# EasyEDA Pro project 51单片机核心板.epro

# Schematic 51单片机核心板原理图
Create Date: 2024-02-12; Page Name: P1; Project Name: 51单片机核心板; Schematic Name: 51单片机核心板原理图; Update Date: 2024-02-13; Company: 南京信息工程大学; Drawed: expert; Page Size: A4; Version: V1.0
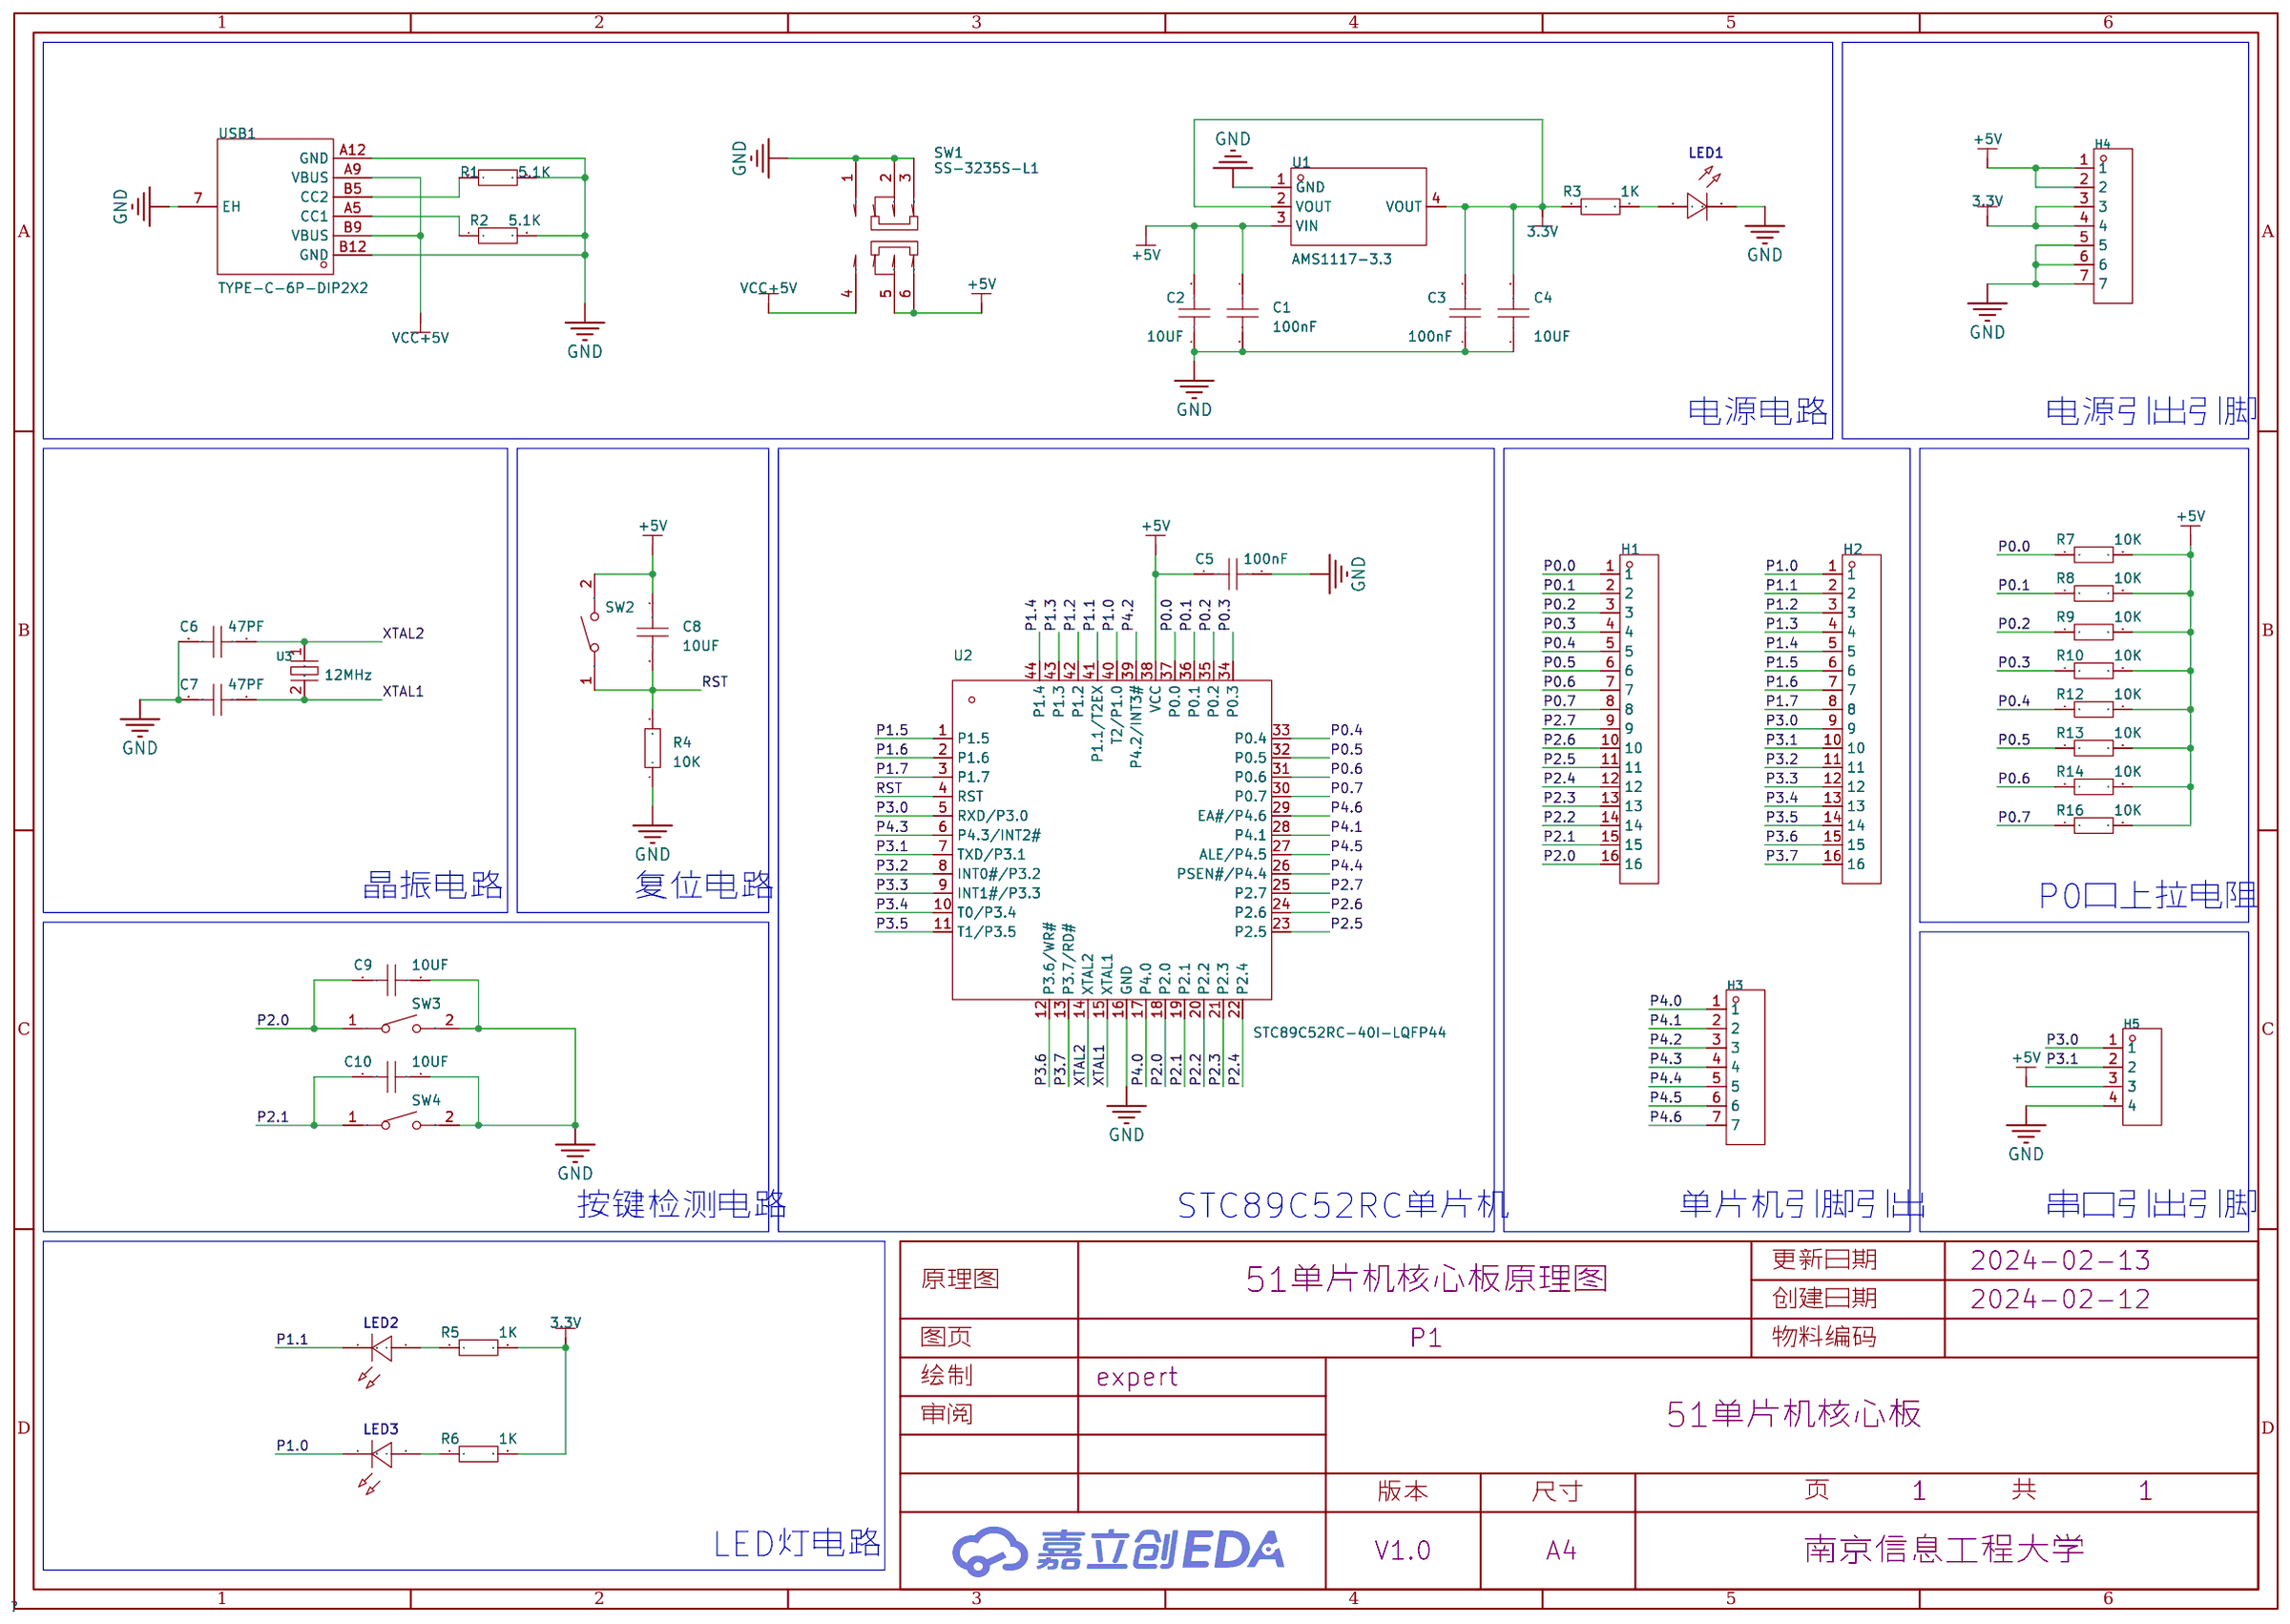
[diagram p0: schematic sheet]

## Parts
C1  100nF  [C0805]
C2  10UF  [C0805]
C3  100nF  [C0805]
C4  10UF  [C0805]
C5  100nF  [C0805]
C6  47PF  [C0805]
C7  47PF  [C0805]
C8  10UF  [C0805]
C9  10UF  [C0805]
C10  10UF  [C0805]
H1  -  [HDR-TH_16P-P2.54-V-M]
H2  -  [HDR-TH_16P-P2.54-V-M]
H3  -  [HDR-TH_7P-P2.54-V-M]
H4  -  [HDR-TH_7P-P2.54-V-M]
H5  -  [HDR-TH_4P-P2.54-V-M]
LED1  -  [LED_0805]
LED2  -  [LED_0805]
LED3  -  [LED_0805]
R1  5.1K  [R0805]
R2  5.1K  [R0805]
R3  1K  [R0805]
R4  10K  [R0805]
R5  1K  [R0805]
R6  1K  [R0805]
R7  10K  [R0805]
R8  10K  [R0805]
R9  10K  [R0805]
R10  10K  [R0805]
R12  10K  [R0805]
R13  10K  [R0805]
R14  10K  [R0805]
R16  10K  [R0805]
SW1  SS-3235S-L1  [SW-SMD_SS-3235S-LX]
SW2  轻触按键3*4*H  [SW-SMD_L4.0-W2.9-LS5.0]
SW3  轻触按键3*4*H  [SW-SMD_L4.0-W2.9-LS5.0]
SW4  轻触按键3*4*H  [SW-SMD_L4.0-W2.9-LS5.0]
U1  AMS1117-3.3  [SOT-223-3_L6.5-W3.4-P2.30-LS7.0-BR]
U2  STC89C52RC-40I-LQFP44  [LQFP-44_L10.0-W10.0-P0.80-LS12.0-BL]
U3  12MHz  [CRYSTAL-SMD_L11.4-W4.7-LS12.7]
USB1  TYPE-C-6P-DIP2X2  [TYPE-C-SMD_TYPE-C-6P]

## Library data of the parts
C1-C10 = CAP_0805: Supplier Footprint: 0805
H1 H2 = HDR-M_2.54_1x16P: 间距:2.54mm;总PIN位数:16;排数:1;插针结构:1x16P;行距:-;安装类型:直插;圆针/方针:方针;额定电流:3A;额定电压:-;配合针长度:6mm;塑高:2.5mm;端接针长度:3mm;触头材质:-;工作温度范围:-40℃~+105℃;颜色:黑色;; Supplier Part: C2894939; Supplier Footprint: 插件
H3 H4 = HDR-M_2.54_1x7P: Supplier Part: C492406; Supplier Footprint: 插件
H5 = HDR-M_2.54_1x4P: Supplier Part: C492403; Supplier Footprint: 插件
LED1-LED3 = LED_0805-G: Supplier Footprint: 0805
R1-R10 R12-R14 R16 = Res_0805: Supplier Footprint: 0805
SW1 = SS-3235S-L1: 电路结构:双刀双掷;安装方式:卧贴;开关颜色:黑色;额定电流(DC):50mA;额定电压(DC):12V;额定电流(AC):50mA;额定电压(AC):12V;机械寿命:1万次;; LCSC Part Name: 柄长2mm 卧贴双档 滑动开关; Supplier Part: C500055; Manufacturer: XKB Connectivity(中国星坤); Supplier Footprint: SMD; JLCPCB Part Class: 扩展库; Datasheet: https://atta.szlcsc.com/upload/public/pdf/source/20211011/39D516E750C13BE9339464E723D9F132.pdf; Supplier: LCSC; Circuit: 双刀双掷; Actuator Style: 矩形柱状; Pin Style: 鸥翼型; Switch Length: 9.1mm; Switch Width: 3.55mm; Switch Height: 3.2mm; Mounting Style: 卧贴; Actuator Color: 黑色; Current Rating (DC): 50mA; Voltage Rating (DC): 12V; Current Rating (AC): 50mA; Voltage Rating (AC): 12V; Mechanical Life: 1万次; Operating Temperature: -40℃~+85℃
SW2-SW4 = 轻触按键3*4*H: Supplier Part: C9900017573; Supplier Footprint: 轻触按键3*4*2.5; JLCPCB Part Class: 扩展库; Supplier: LCSC
U1 = AMS1117-3.3_C6186: 输出类型:固定;最大输入电压:-;输出电压:3.3V;最大输出电流:1A;电源纹波抑制比(PSRR):72dB@(120Hz);输出极性:正极;; LCSC Part Name: 输出3.3V 1A; Supplier Part: C6186; Manufacturer: AMS; Supplier Footprint: SOT-223-3; JLCPCB Part Class: 基础库; Datasheet: https://atta.szlcsc.com/upload/public/pdf/source/20180727/C6186_7A095716F0823C02F1997A905E26C086.pdf; Supplier: LCSC; Output Type: 固定; Output Voltage: 3.3V; MAX Output Current: 1A; Power Supply Rejection Ratio (PSRR): 72dB@(120Hz); Dropout Voltage: 1.3V@(800mA); Output Polarity: 正极; Number of Outputs: 1
U2 = STC89C52RC-40I-LQFP44: CPU内核:51系列;程序存储容量:8KB;RAM总容量:512Byte;GPIO端口数量:39;工作电压范围:3.3V~5.5V;CPU最大主频:-;程序存储器类型:FLASH;; Supplier Part: C8707; Manufacturer: STC(宏晶); Supplier Footprint: LQFP-44(10x10); JLCPCB Part Class: 扩展库; Datasheet: https://atta.szlcsc.com/upload/public/pdf/source/20131218/1457706663573.pdf; Supplier: LCSC; CPU Core: 51系列; Program Storage Size: 8KB; RAM Size: 512Byte; GPIO Ports Number: 39; Operating Voltage Range: 3.3V~5.5V; Program Memory Type: FLASH; Operating Temperature Range: -40℃~+85℃; 16Bit Timer: 3; UART/USART: 1; Peripheral/Function: 看门狗; Watchdog: 有
U3 = ABLS-12.000MHZ-B4H-T: 频率:12MHz;常温频差:±30ppm;外接负载电容:18pF;频率稳定度(全温):±35ppm;; LCSC Part Name: 12MHz ±30ppm 18pF; Supplier Part: C1986452; Manufacturer: ABRACON; Supplier Footprint: HC-49S-SMD; JLCPCB Part Class: 扩展库; Datasheet: https://atta.szlcsc.com/upload/public/pdf/source/20210612/96A8D0E14BE5C26ADD56CBF11909D043.pdf; Supplier: LCSC; Normal temperature Frequency Tolerance: ±30ppm; External load capacitor: 18pF; Frequency Stability(Full temperature range): ±35ppm; Equivalent Series Resistance (ESR): 50Ω; Operating Temperature: -20℃~+70℃
USB1 = TYPE-C-6P-DIP2X2: Supplier Part: C9900017627; Supplier Footprint: TYPE-C-6P; JLCPCB Part Class: 扩展库; Supplier: LCSC

## Nets
3.3V: C3.2 C4.2 H4.3 H4.4 R3.1 R5.2 R6.2 U1.2(VOUT) U1.4(VOUT)
+5V: C1.1 C2.2 C5.1 C8.1 H4.1 H4.2 H5.3 R7.2 R8.2 R9.2 R10.2 R12.2 R13.2 R14.2 R16.2 SW1.5 SW1.6 SW2.2 U1.3(VIN) U2.38(VCC)
GND: C1.2 C2.1 C3.1 C4.1 C5.2 C6.2 C7.2 C9.2 C10.2 H4.5 H4.6 H4.7 H5.4 LED1.1(C) R1.2 R2.2 R4.1 SW1.1 SW1.2 SW1.3 SW3.2 SW4.2 U1.1(GND) U2.16(GND) USB1.7(EH) USB1.A12(GND) USB1.B12(GND)
VCC+5V: SW1.4 USB1.A9(VBUS) USB1.B9(VBUS)
P0.0: H1.1 R7.1 U2.37(P0.0)
P0.1: H1.2 R8.1 U2.36(P0.1)
P0.2: H1.3 R9.1 U2.35(P0.2)
P0.3: H1.4 R10.1 U2.34(P0.3)
P0.4: H1.5 R12.1 U2.33(P0.4)
P0.5: H1.6 R13.1 U2.32(P0.5)
P0.6: H1.7 R14.1 U2.31(P0.6)
P0.7: H1.8 R16.1 U2.30(P0.7)
P1.0: H2.1 LED3.1(C) U2.40(T2/P1.0)
P1.1: H2.2 LED2.1(C) U2.41(P1.1/T2EX)
P1.2: H2.3 U2.42(P1.2)
P1.3: H2.4 U2.43(P1.3)
P1.4: H2.5 U2.44(P1.4)
P1.5: H2.6 U2.1(P1.5)
P1.6: H2.7 U2.2(P1.6)
P1.7: H2.8 U2.3(P1.7)
P2.0: C9.1 H1.16 SW3.1 U2.18(P2.0)
P2.1: C10.1 H1.15 SW4.1 U2.19(P2.1)
P2.2: H1.14 U2.20(P2.2)
P2.3: H1.13 U2.21(P2.3)
P2.4: H1.12 U2.22(P2.4)
P2.5: H1.11 U2.23(P2.5)
P2.6: H1.10 U2.24(P2.6)
P2.7: H1.9 U2.25(P2.7)
P3.0: H2.9 H5.1 U2.5(RXD/P3.0)
P3.1: H2.10 H5.2 U2.7(TXD/P3.1)
P3.2: H2.11 U2.8(INT0#/P3.2)
P3.3: H2.12 U2.9(INT1#/P3.3)
P3.4: H2.13 U2.10(T0/P3.4)
P3.5: H2.14 U2.11(T1/P3.5)
P3.6: H2.15 U2.12(P3.6/WR#)
P3.7: H2.16 U2.13(P3.7/RD#)
P4.0: H3.1 U2.17(P4.0)
P4.1: H3.2 U2.28(P4.1)
P4.2: H3.3 U2.39(P4.2/INT3#)
P4.3: H3.4 U2.6(P4.3/INT2#)
P4.4: H3.5 U2.26(PSEN#/P4.4)
P4.5: H3.6 U2.27(ALE/P4.5)
P4.6: H3.7 U2.29(EA#/P4.6)
RST: C8.2 R4.2 SW2.1 U2.4(RST)
XTAL1: C7.1 U2.15(XTAL1) U3.2(GND)
XTAL2: C6.1 U2.14(XTAL2) U3.1
$1N199: R1.1 USB1.B5(CC2)
$1N203: R2.1 USB1.A5(CC1)
$1N789: LED1.2(A) R3.2
$1N4250: LED2.2(A) R5.1
$1N4257: LED3.2(A) R6.1

## Notes on the sheet
- 电源电路
- 电源引出引脚
- 晶振电路
- 复位电路
- P0口上拉电阻
- 按键检测电路
- STC89C52RC单片机
- 单片机引脚引出
- 串口引出引脚
- LED灯电路

# Board 51单片机核心板PCB
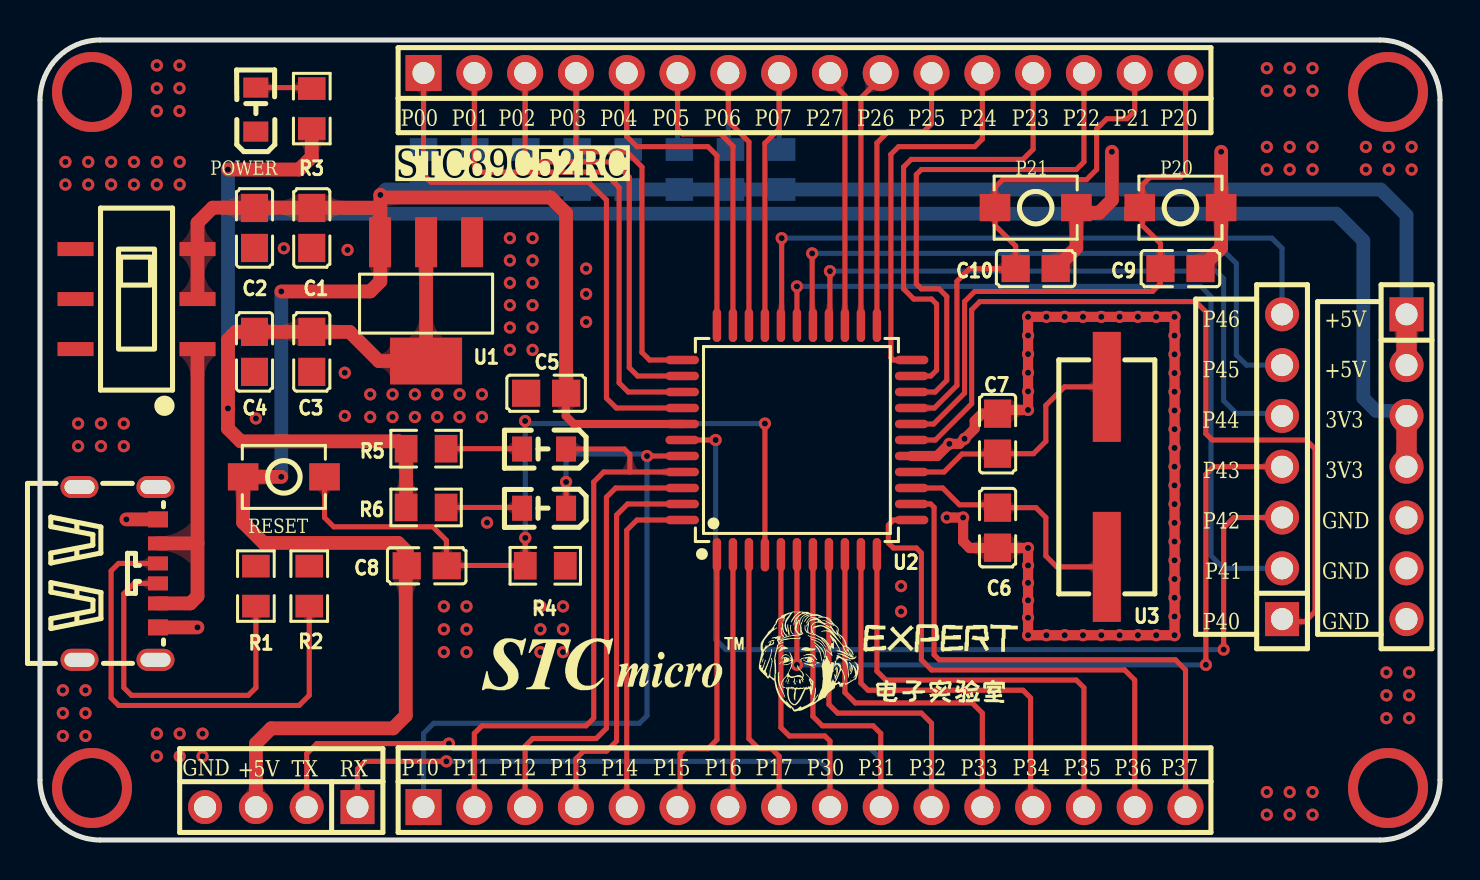
[diagram p1: board, top side]
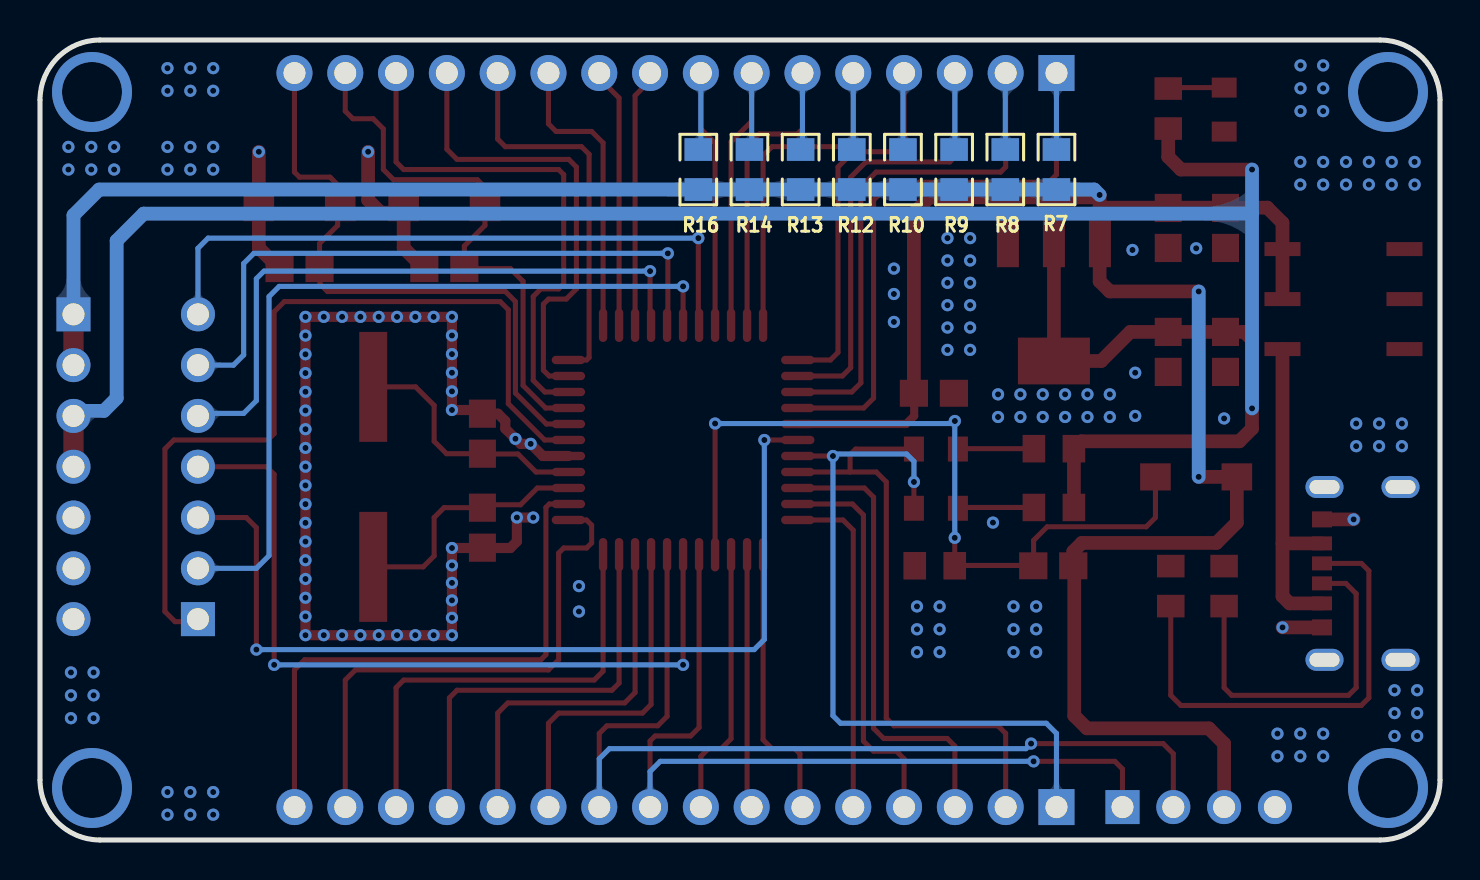
[diagram p2: board, bottom side, seen from below]

Outline 70 x 40 mm; copper layers: Top Layer, Bottom Layer. Coordinates in mm from the lower left corner of the outline.
Outline path: 0,37 0,3 arc(0.88,0.88) 3,0 67,0 arc(69.12,0.88) 70,3 70,37 arc(69.12,39.12) 67,40 3,40 arc(0.88,39.12) 0,37
Stack: Top Layer 0.035mm / Dielectric1 1.51mm FR4 er 4.5 / Bottom Layer 0.035mm

## Design rules (mm)
net XTAL2: DP1
net XTAL1: DP1
template: JLCPCB Capability(Two Layers Board)
spacing copperThickness1oz (default): track to track 0.102, other pairs 0.152 to 0.3
spacing copperThickness2oz: track to track 0.203, other pairs 0.152 to 0.3
track width copperThickness1oz (default): min 0.127, default 0.254, max 2.54
track width copperThickness2oz: min 0.203, default 0.254, max 2.54
differential pair differentialPair (default): width min 0.127, default 0.254, max 2.54; gap min 0.152, default 0.152
via viaSize (default): diameter min 0.5, default 0.61, max 10; hole min 0.3, default 0.305, max 6.3

## Placement (name value [footprint] x y rotation side)
C1  100nF  [C0805]  13.59 30.6 270 top
C2  10UF  [C0805]  10.72 30.6 90 top
C3  100nF  [C0805]  13.59 24.41 90 top
C4  10UF  [C0805]  10.72 24.41 90 top
C5  100nF  [C0805]  25.31 22.34 180 top
C6  47PF  [C0805]  47.88 15.62 270 top
C7  47PF  [C0805]  47.88 20.31 90 top
C8  10UF  [C0805]  19.34 13.71 0 top
C9  10UF  [C0805]  57.02 28.57 0 top
C10  10UF  [C0805]  49.78 28.57 0 top
H1  -  [HDR-TH_16P-P2.54-V-M]  38.23 38.35 0 top
H2  -  [HDR-TH_16P-P2.54-V-M]  38.23 1.65 0 top
H3  -  [HDR-TH_7P-P2.54-V-M]  62.1 18.66 90 top
H4  -  [HDR-TH_7P-P2.54-V-M]  68.33 18.66 270 top
H5  -  [HDR-TH_4P-P2.54-V-M]  12.06 1.65 180 top
LED1  -  [LED_0805]  10.8 36.57 90 top
LED2  -  [LED_0805]  25.15 19.55 180 top
LED3  -  [LED_0805]  25.15 16.59 180 top
R1  5.1K  [R0805]  10.8 12.69 90 top
R2  5.1K  [R0805]  13.46 12.69 90 top
R3  1K  [R0805]  13.59 36.57 90 top
R4  10K  [R0805]  25.26 13.71 180 top
R5  1K  [R0805]  19.3 19.57 180 top
R6  1K  [R0805]  19.3 16.63 180 top
R7  10K  [R0805]  19.18 33.52 270 bottom
R8  10K  [R0805]  21.74 33.52 270 bottom
R9  10K  [R0805]  24.29 33.52 270 bottom
R10  10K  [R0805]  26.85 33.52 270 bottom
R12  10K  [R0805]  29.41 33.52 270 bottom
R13  10K  [R0805]  31.97 33.52 270 bottom
R14  10K  [R0805]  34.53 33.52 270 bottom
R16  10K  [R0805]  37.08 33.52 270 bottom
SW1  SS-3235S-L1  [SW-SMD_SS-3235S-LX]  4.83 27.05 90 top
SW2  轻触按键3*4*H  [SW-SMD_L4.0-W2.9-LS5.0]  12.19 18.16 180 top
SW3  轻触按键3*4*H  [SW-SMD_L4.0-W2.9-LS5.0]  57.02 31.62 0 top
SW4  轻触按键3*4*H  [SW-SMD_L4.0-W2.9-LS5.0]  49.78 31.62 0 top
U1  AMS1117-3.3  [SOT-223-3_L6.5-W3.4-P2.30-LS7.0-BR]  19.3 26.92 90 top
U2  STC89C52RC-40I-LQFP44  [LQFP-44_L10.0-W10.0-P0.80-LS12.0-BL]  37.85 20 0 top
U3  12MHz  [CRYSTAL-SMD_L11.4-W4.7-LS12.7]  53.34 18.16 90 top
USB1  TYPE-C-6P-DIP2X2  [TYPE-C-SMD_TYPE-C-6P]  3.94 13.33 270 top

## Footprints (pads in the part's own frame, mm; a bottom-side part is the same pattern mirrored in y, then rotated)
C0805
  rect 1.41x1.35 smd: 1(-1,0) 2(1,0)
CRYSTAL-SMD_L11.4-W4.7-LS12.7
  rect 5.5x1.4 smd: 1(-4.5,0) 2(4.5,0)
HDR-TH_4P-P2.54-V-M
  rect 1.7x1.7 hole 1.1: 1(-3.81,0)
  round 1.7 hole 1.1: 2(-1.27,0) 3(1.27,0) 4(3.81,0)
HDR-TH_7P-P2.54-V-M
  rect 1.7x1.7 hole 1.1: 1(-7.62,0)
  round 1.7 hole 1.1: 2(-5.08,0) 3(-2.54,0) 4(0,0) 5(2.54,0) 6(5.08,0) 7(7.62,0)
HDR-TH_16P-P2.54-V-M
  rect 1.8x1.8 hole 1.1: 1(-19.05,0)
  round 1.8 hole 1.1: 2(-16.51,0) 3(-13.97,0) 4(-11.43,0) 5(-8.89,0) 6(-6.35,0) 7(-3.81,0) 8(-1.27,0) 9(1.27,0) 10(3.81,0) 11(6.35,0) 12(8.89,0) 13(11.43,0) 14(13.97,0) 15(16.51,0) 16(19.05,0)
LED_0805
  rect 1x1.25 smd: 1(-1.15,0.005) 2(1.05,0.005)
LQFP-44_L10.0-W10.0-P0.80-LS12.0-BL
  oval 0.42x1.67 smd: 1(-4,-5.735) 2(-3.2,-5.735) 3(-2.4,-5.735) 4(-1.6,-5.735) 5(-0.8,-5.735) 6(0,-5.735) 7(0.8,-5.735) 8(1.6,-5.735) 9(2.4,-5.735) 10(3.2,-5.735) 11(4,-5.735) 23(4,5.735) 24(3.2,5.735) 25(2.4,5.735) 26(1.6,5.735) 27(0.8,5.735) 28(0,5.735) 29(-0.8,5.735) 30(-1.6,5.735) 31(-2.4,5.735) 32(-3.2,5.735) 33(-4,5.735)
  oval 1.67x0.42 smd: 12(5.735,-4) 13(5.735,-3.2) 14(5.735,-2.4) 15(5.735,-1.6) 16(5.735,-0.8) 17(5.735,0) 18(5.735,0.8) 19(5.735,1.6) 20(5.735,2.4) 21(5.735,3.2) 22(5.735,4) 34(-5.735,4) 35(-5.735,3.2) 36(-5.735,2.4) 37(-5.735,1.6) 38(-5.735,0.8) 39(-5.735,0) 40(-5.735,-0.8) 41(-5.735,-1.6) 42(-5.735,-2.4) 43(-5.735,-3.2) 44(-5.735,-4)
R0805
  rect 1.133x1.377 smd: 1(-1,0) 2(1,0)
SOT-223-3_L6.5-W3.4-P2.30-LS7.0-BR
  rect 2.5x1.1 smd: 1(2.97,-2.3) 2(2.97,0) 3(2.97,2.3)
  rect 2.34x3.6 smd: 4(-2.97,0)
SW-SMD_L4.0-W2.9-LS5.0
  rect 1.53x1.36 smd: 1(-2.035,0) 2(2.035,0)
SW-SMD_SS-3235S-LX
  rect 0.7x1.8 smd: 1(-2.5,3.05) 2(0,3.05) 3(2.5,3.05) 4(-2.5,-3.05) 5(0,-3.05) 6(2.5,-3.05)
TYPE-C-SMD_TYPE-C-6P
  oval 1.1x1.9 hole 0.7x1.5: 7(-4.32,1.837) 7(-4.32,-1.962) 7(4.32,1.837) 7(4.32,-1.962)
  rect 0.7x1 smd: A5(-0.5,1.962) A9(1.5,1.962) B5(0.5,1.962) B9(-1.5,1.962)
  rect 0.8x1 smd: A12(2.7,1.962) B12(-2.7,1.962)

## Nets
As in the schematic.

## Via types
v1: diameter 4, hole 3, Top Layer to Bottom Layer, 4 vias
v2: diameter 0.61, hole 0.305, Top Layer to Bottom Layer, 185 vias

## Routing (per net, layer and track width the routed paths; a pad name or vN(x,y) marks a point on that pad's centre or on a via; arc(x,y) is an arc through that point)
3.3V: length 121.4
  Top Layer w0.686: U1.2 U1.4 16.94,23.95 15.48,25.41 C3.2 C4.2 9.79,25.41 9.4,25.01 v2(9.4,21.58) 9.4,20.57 10.03,19.93 17.94,19.93 R5.2 R6.2 ; v2(9.4,33.52) 12.95,33.52 13.59,34.16 R3.1
  Top Layer w1.016: H4.3 H4.4
  Bottom Layer w0.686: v2(9.4,21.58) 9.4,31.32 ; 9.4,31.32 v2(9.4,33.52) ; 9.4,31.32 64.82,31.32 66.17,29.97 66.17,22.09 66.8,21.46 68.07,21.46 H4.3
+5V: length 149.8
  Top Layer w0.406: C5.1 26.29,22.32 26.29,21.2 26.69,20.8 U2.38
  Top Layer w0.686: H5.3 10.8,4.82 11.56,5.58 17.65,5.58 18.29,6.22 18.29,13.66 C8.1 18.34,14.42 17.91,14.85 11.18,14.85 10.16,15.87 SW2.2 v2(12.06,18.16) ; 10.71,31.62 13.57,31.62 ; 10.71,31.62 C2.2 ; 10.71,31.62 8.64,31.62 7.88,30.86 SW1.6 SW1.5 ; 13.57,31.62 C1.1 ; 13.57,31.62 17.02,31.62 ; 17.02,31.62 v2(17.02,32.25) 17.14,32.13 25.53,32.13 26.31,31.35 C5.1 ; 17.02,31.62 17.02,29.9 U1.3 17.02,29.88 17.02,27.94 16.51,27.43 v2(12.06,27.43)
  Top Layer w1.016: H4.1 H4.2
  Bottom Layer w0.686: v2(17.02,32.25) 17.29,32.52 R7.2 R8.2 R9.2 R10.2 R12.2 R13.2 R14.2 R16.2 67.04,32.52 68.33,31.24 H4.1 ; v2(12.06,18.16) v2(12.06,27.43)
GND: length 69.5
  Top Layer w0.508: v2(45.34,16.12) v2(46.16,16.12) 46.16,14.93 46.48,14.6 47.86,14.6 ; 47.86,14.6 v2(49.4,14.6) v2(49.4,13.73) v2(49.4,12.86) v2(49.4,11.98) v2(49.4,11.11) v2(49.4,10.24) v2(50.32,10.24) v2(51.23,10.24) v2(52.15,10.24) v2(53.06,10.24) v2(53.98,10.24) v2(54.9,10.24) v2(55.81,10.24) v2(56.73,10.24) v2(56.73,11.18) v2(56.73,12.11) v2(56.73,13.05) v2(56.73,13.99) v2(56.73,14.92) v2(56.73,15.86) v2(56.73,16.79) v2(56.73,17.73) v2(56.73,18.67) v2(56.73,19.6) v2(56.73,20.54) v2(56.73,21.48) v2(56.73,22.41) v2(56.73,23.35) v2(56.73,24.28) v2(56.73,25.22) v2(56.73,26.16) v2(55.81,26.16) v2(54.9,26.16) v2(53.98,26.16) v2(53.06,26.16) v2(52.15,26.16) v2(51.23,26.16) v2(50.32,26.16) v2(49.4,26.16) v2(49.4,25.23) v2(49.4,24.29) v2(49.4,23.36) v2(49.4,22.43) v2(49.4,21.5) 48.06,21.5 C7.2 47.1,21.31 46.74,20.95 46.74,20.57 v2(46.23,20.06) 45.97,19.81 v2(45.47,19.81) 44.86,19.2 43.58,19.2 ; 47.86,14.6 C6.2
  Top Layer w0.686: v2(59.06,34.41) SW3.2 59.06,29.61 C9.2 ; USB1.A12 v2(7.87,10.63) ; 52.07,31.36 52.96,31.36 53.59,32 v2(53.59,34.41) ; SW4.2 51.82,29.61 C10.2 ; USB1.B12 v2(4.32,16.03)
  vias: v2(1.14,7.49) v2(1.14,6.34) v2(1.14,5.2) v2(1.27,33.9) v2(1.27,32.77) v2(1.91,20.82) v2(1.91,19.69) v2(2.28,7.49) v2(2.28,6.34) v2(2.28,5.2) v2(2.41,33.9) v2(2.41,32.77) v2(3.05,20.82) v2(3.05,19.69) v2(3.56,33.9) v2(3.56,32.77) v2(4.19,20.82) v2(4.19,19.69) v2(4.7,33.9) v2(4.7,32.77) v2(5.84,38.73) v2(5.84,37.59) v2(5.84,36.44) v2(5.84,33.9) v2(5.84,32.77) v2(5.84,5.32) v2(5.84,4.19) v2(6.97,38.73) v2(6.97,37.59) v2(6.97,36.44) v2(6.98,33.9) v2(6.98,32.77) v2(6.98,5.32) v2(6.98,4.19) v2(8.13,5.32) v2(8.13,4.19) v2(10.8,21.08) v2(12.19,29.59) v2(15.24,23.36) v2(15.24,21.2) v2(15.38,29.5) v2(16.51,22.28) v2(16.51,21.15) v2(17.63,22.28) v2(17.63,21.15) v2(18.75,22.28) v2(18.75,21.15) v2(19.86,22.28) v2(19.86,21.15) v2(20.19,11.68) v2(20.19,10.54) v2(20.19,9.39) v2(20.98,22.28) v2(20.98,21.15) v2(21.32,11.68) v2(21.32,10.54) v2(21.32,9.39) v2(22.1,22.28) v2(22.1,21.15) v2(22.35,15.87) v2(23.5,30.09) v2(23.5,28.98) v2(23.5,27.86) v2(23.5,26.74) v2(23.5,25.62) v2(23.5,24.51) v2(24.63,30.09) v2(24.63,28.98) v2(24.63,27.86) v2(24.63,26.74) v2(24.63,25.62) v2(24.63,24.51) v2(25.02,11.68) v2(25.02,10.54) v2(25.02,9.39) v2(26.15,11.68) v2(26.15,10.54) v2(26.15,9.39) v2(27.31,28.57) v2(27.31,27.3) v2(27.31,25.9) v2(43.05,12.69) v2(43.05,11.42) v2(61.34,38.59) v2(61.34,37.46) v2(61.34,34.66) v2(61.34,33.52) v2(61.34,2.4) v2(61.34,1.26) v2(62.48,38.59) v2(62.48,37.46) v2(62.48,34.66) v2(62.48,33.52) v2(62.48,2.4) v2(62.48,1.26) v2(63.63,38.59) v2(63.63,37.46) v2(63.63,34.66) v2(63.63,33.52) v2(63.63,2.4) v2(63.63,1.26) v2(66.29,34.66) v2(66.29,33.52) v2(67.32,8.38) v2(67.32,7.23) v2(67.32,6.09) v2(67.44,34.66) v2(67.44,33.52) v2(68.45,8.38) v2(68.45,7.23) v2(68.45,6.09) v2(68.58,34.66) v2(68.58,33.52)
VCC+5V: length 16.5
  Top Layer w0.686: SW1.4 7.87,24.54 7.87,14.83 ; USB1.A9 7.52,11.83 7.87,12.19 7.87,14.83 ; 7.87,14.83 USB1.B9
(no net):
  vias: v1(2.6,37.4) v1(2.6,2.6) v1(67.4,37.4) v1(67.4,2.6)
P0.0: length 32.5
  Top Layer w0.254: H1.1 19.18,33.27 19.56,32.89 27.43,32.89 28.32,32 28.32,22.09 28.81,21.6 U2.37
  Bottom Layer w0.254: H1.1 R7.1
P0.1: length 29.3
  Top Layer w0.254: U2.36 29.41,22.4 28.96,22.86 28.96,32.63 28.19,33.4 21.97,33.4 21.72,33.65 H1.2
  Bottom Layer w0.254: H1.2 21.74,38.33 R8.1
P0.2: length 26
  Top Layer w0.254: U2.35 29.88,23.2 29.46,23.62 29.46,33.14 28.7,33.9 24.51,33.9 24.26,34.16 H1.3
  Bottom Layer w0.254: H1.3 24.26,34.56 R9.1
P0.3: length 22.7
  Top Layer w0.254: H1.4 26.8,34.67 27.05,34.41 29.34,34.41 30.1,33.65 30.1,24.38 30.48,24 U2.34
  Bottom Layer w0.254: H1.4 26.85,38.29 R10.1
P0.4: length 20.4
  Top Layer w0.254: U2.33 33.85,34.22 33.4,34.67 29.84,34.67 29.34,35.17 H1.5
  Bottom Layer w0.254: R12.1 29.34,34.6 H1.5
P0.5: length 18.7
  Top Layer w0.254: H1.6 31.88,35.56 32.13,35.3 34.04,35.3 34.65,34.69 U2.32
  Bottom Layer w0.254: R13.1 31.88,34.61 H1.6
P0.6: length 16.9
  Top Layer w0.254: H1.7 34.42,35.94 35.45,34.91 U2.31
  Bottom Layer w0.254: R14.1 34.42,34.63 H1.7
P0.7: length 16.8
  Top Layer w0.254: U2.30 36.25,34.84 36.96,35.56 H1.8
  Bottom Layer w0.254: H1.8 36.96,34.65 R16.1
P1.0: length 36.6
  Top Layer w0.254: LED3.1 v2(26.3,17.9) ; U2.40 v2(30.35,19.2)
  Bottom Layer w0.254: v2(26.3,17.9) 26.3,18.93 26.67,19.3 30.25,19.3 v2(30.35,19.2) 30.35,6.22 29.97,5.84 19.69,5.84 19.18,5.33 H2.1
P1.1: length 30.6
  Top Layer w0.254: 29.5,18.4 28.18,18.4 27.69,17.9 27.69,6.09 27.31,5.71 22.1,5.71 21.72,5.33 H2.2 ; 29.5,18.4 29.5,19.27 29.22,19.55 LED2.1 ; 29.5,18.4 U2.41
P1.2: length 23
  Top Layer w0.254: U2.42 28.78,17.6 28.32,17.14 28.32,5.58 27.81,5.08 24.64,5.08 24.26,4.69 H2.3
P1.3: length 19.6
  Top Layer w0.254: H2.4 26.8,4.06 27.18,4.44 28.32,4.44 28.83,4.95 28.83,16.25 29.38,16.8 U2.43
P1.4: length 16.8
  Top Layer w0.254: U2.44 29.85,16 29.34,15.49 H2.5
P1.5: length 14.1
  Top Layer w0.254: H2.6 32,1.77 32,4.31 32.26,4.57 33.4,4.57 33.85,5.01 U2.1
P1.6: length 12.7
  Top Layer w0.254: U2.2 34.65,1.88 H2.7
P1.7: length 13.6
  Top Layer w0.254: U2.3 35.45,5.06 35.94,4.57 36.58,4.57 36.96,4.19 H2.8
P2.0: length 30.9
  Top Layer w0.254: 43.58,20.8 44.68,20.8 46.23,22.35 46.23,26.92 46.74,27.43 55.63,27.43 56.01,27.81 56.01,28.55 C9.1 56.02,29.82 55.12,30.73 55.12,31.49 ; 55.12,31.49 55.12,32.76 55.5,33.14 57.02,33.14 57.28,33.4 57.28,38.35 ; 55.12,31.49 SW3.1
P2.1: length 27.3
  Top Layer w0.254: 43.58,21.6 44.72,21.6 45.85,22.73 45.85,27.94 46.48,28.57 C10.1 48.78,29.7 47.75,30.73 47.75,31.61 SW4.1 47.75,32.63 48.13,33.02 52.32,33.02 52.83,33.52 52.83,35.56 53.34,36.06 54.36,36.06 54.74,36.44 H1.15
P2.2: length 26.5
  Top Layer w0.254: H1.14 52.2,33.9 51.82,33.52 44.07,33.52 43.81,33.27 43.81,27.81 44.07,27.55 44.96,27.55 45.34,27.17 45.34,22.98 44.76,22.4 43.58,22.4
P2.3: length 23.4
  Top Layer w0.254: H1.13 49.66,34.54 49.15,34.03 43.56,34.03 43.18,33.65 43.18,27.55 43.69,27.05 44.58,27.05 44.83,26.79 44.83,23.49 44.54,23.2 43.58,23.2
P2.4: length 19.4
  Top Layer w0.254: 43.58,24 42.67,24 42.54,24.13 42.54,34.28 42.93,34.67 46.74,34.67 47.12,35.05 47.12,38.35
P2.5: length 14.8
  Top Layer w0.254: H1.11 44.58,35.81 44.2,35.43 42.42,35.43 41.85,34.86 U2.23
P2.6: length 13
  Top Layer w0.254: H1.10 42.04,38.09 41.05,37.1 U2.24
P2.7: length 12.9
  Top Layer w0.254: U2.25 40.25,37.22 39.5,37.97 H1.9
P3.0: length 42.3
  Top Layer w0.254: U2.5 37.05,5.62 37.47,5.2 39.24,5.2 39.5,4.95 H2.9 ; v2(20.32,3.93) 16.26,3.93 15.88,3.55 H5.1
  Bottom Layer w0.254: H2.9 39.5,3.42 38.99,3.93 v2(20.32,3.93)
P3.1: length 49.8
  Top Layer w0.254: U2.7 38.65,6.18 39.12,5.71 41.66,5.71 42.04,5.33 H2.10 ; v2(20.45,4.82) 13.84,4.82 13.33,4.31 H5.2
  Bottom Layer w0.254: v2(20.45,4.82) 20.7,4.57 41.53,4.57 42.04,4.06 H2.10
P3.2: length 17.2
  Top Layer w0.254: H2.11 44.58,5.84 44.07,6.34 39.88,6.34 39.45,6.78 U2.8
P3.3: length 18.9
  Top Layer w0.254: 47.12,1.65 47.12,6.34 46.61,6.85 40.77,6.85 40.25,7.37 U2.9
P3.4: length 20.7
  Top Layer w0.254: U2.10 41.05,7.84 41.4,7.49 49.15,7.49 49.53,7.11 49.53,1.77 H2.13
P3.5: length 22.5
  Top Layer w0.254: U2.11 41.85,8.44 42.29,8 51.82,8 52.2,7.61 H2.14
P3.6: length 26.8
  Top Layer w0.254: 43.58,16 42.68,16 42.42,15.74 42.42,14.85 42.67,14.6 43.81,14.6 44.07,14.35 44.07,9.01 44.58,8.5 54.23,8.5 54.74,8 H2.15
P3.7: length 28.3
  Top Layer w0.254: 57.28,1.65 57.28,8.5 56.77,9.01 44.96,9.01 44.7,9.27 44.7,16.63 44.54,16.8 43.58,16.8
P4.0: length 42.5
  Top Layer w0.254: H3.1 62.23,10.92 63.25,10.92 63.75,11.42 63.75,19.55 63.31,20 58.61,20 58.29,20.31 58.29,26.41 57.78,26.92 46.99,26.92 46.58,26.51 46.58,21.81 44.77,20 43.58,20
P4.1: length 39.6
  Top Layer w0.254: U2.28 v2(37.85,27.68)
  Bottom Layer w0.254: H3.2 59.18,13.58 58.55,14.22 58.55,27.17 58.04,27.68 v2(37.85,27.68)
P4.2: length 46.5
  Top Layer w0.254: H3.3 59.69,16.12 59.18,15.62 v2(59.18,9.52) ; U2.39 v2(33.78,20)
  Bottom Layer w0.254: v2(59.18,9.52) 34.29,9.52 33.78,10.03 v2(33.78,20)
P4.3: length 39.4
  Top Layer w0.254: v2(58.29,8.76) 58.29,18.28 58.67,18.66 H3.4 ; U2.6 v2(37.85,8.76)
  Bottom Layer w0.254: v2(37.85,8.76) v2(58.29,8.76)
P4.4: length 31.9
  Top Layer w0.254: U2.26 39.5,25.79 v2(39.5,28.44)
  Bottom Layer w0.254: H3.5 61.98,21.33 59.82,21.33 59.18,21.97 59.18,28.06 58.8,28.44 v2(39.5,28.44)
P4.5: length 32.1
  Top Layer w0.254: v2(38.61,29.33) 38.61,25.77 U2.27
  Bottom Layer w0.254: v2(38.61,29.33) 59.31,29.33 59.82,28.82 59.82,24.25 60.32,23.74 H3.6
P4.6: length 32.9
  Top Layer w0.254: U2.29 37.08,25.77 v2(37.08,30.09)
  Bottom Layer w0.254: H3.7 62.1,29.59 61.59,30.09 v2(37.08,30.09)
RST: length 39.7
  Top Layer w0.254: v2(24.26,15.11) R4.2 24.25,13.73 20.32,13.73 ; 14.23,18.16 14.23,16.12 14.69,15.66 19.64,15.66 20.32,14.98 20.32,13.73 ; U2.4 v2(36.25,20.82) ; 20.32,13.73 C8.2
  Bottom Layer w0.254: v2(36.25,20.82) 24.38,20.82 24.26,20.94 ; v2(24.26,15.11) 24.26,20.94 ; 24.26,20.94 v2(24.26,20.95)
XTAL1: length 12.6
  Top Layer w0.254: U3.2 51.22,22.66 50.29,21.73 50.29,19.93 49.67,19.31 C7.1 47.86,19.3 46.1,19.3 45.2,18.4 43.58,18.4
XTAL2: length 12.5
  Top Layer w0.254: 43.58,17.6 45.13,17.6 45.97,16.76 47.74,16.76 C6.1 49.8,16.62 50.29,16.12 50.29,14.2 50.84,13.66 U3.1
$1N199: length 17.6
  Top Layer w0.254: R1.1 10.8,7.61 10.41,7.23 4.57,7.23 4.19,7.61 4.19,12.31 4.71,12.83 USB1.B5
$1N203: length 23.6
  Top Layer w0.254: USB1.A5 3.93,13.83 3.56,13.46 3.56,7.11 3.94,6.73 12.95,6.73 13.46,7.23 R2.1
$1N789: length 2.8
  Top Layer w0.254: LED1.2 13.54,37.62 R3.2
$1N4250: length 3.8
  Top Layer w0.254: R5.1 24.09,19.57 LED2.2
$1N4257: length 3.8
  Top Layer w0.254: LED3.2 24.06,16.63 R6.1

## Copper pours and planes (outline as drawn; the poured copper is in the pictures)
GND on Top Layer: -2.41,41.78 71.88,41.78 71.88,-2.04 -2.41,-2.04
GND on Top Layer: -2.16,42.03 72.01,42.03 72.01,-2.04 -2.16,-2.04
GND on Bottom Layer: -1.91,42.03 72.26,42.03 72.26,-2.16 -1.91,-2.16
GND on Bottom Layer: -2.79,42.03 72.52,42.03 72.52,-2.8 -2.79,-2.8

Small or netless copper shapes (teardrops, artwork), in the pictures only: 209 on Top Layer, 59 on Bottom Layer

## Text on the board
Top Silkscreen Layer: POWER | RESET | P21 | P20 | GND | +5V | TX | RX | P00 | P10 | P01 | P11 | P02 | P12 | P03 | P13 | P04 | P14 | P05 | P15 | P06 | P16 | P07 | P17 | P27 | P30 | P26 | P31 | P25 | P32 | P24 | P33 | P23 | P34 | P22 | P35 | P36 | P37 | P44 | P45 | P43 | P40 | P46 | P42 | P41 | 3V3 | STC89C52RC
